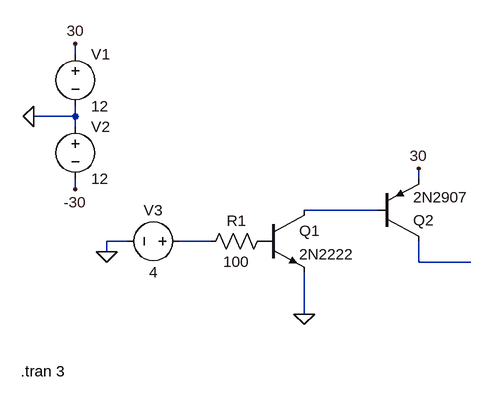
[diagram p0: schematic CurrentAmpTestBlock.asc]
CurrentAmpTestBlock.asc, the LTspice schematic file:
Version 4
SHEET 1 880 680
WIRE -128 -160 -128 -176
WIRE -128 -64 -128 -80
WIRE -128 -64 -192 -64
WIRE -128 -48 -128 -64
WIRE 400 32 400 16
WIRE -128 48 -128 32
WIRE 336 80 224 80
WIRE -48 128 -80 128
WIRE 80 128 32 128
WIRE -80 144 -80 128
WIRE 400 160 400 128
WIRE 480 160 400 160
WIRE 224 240 224 176
FLAG 400 16 30
FLAG -192 -64 0
FLAG -128 -176 30
FLAG -128 48 -30
FLAG -80 144 0
FLAG 224 240 0
SYMBOL res 176 112 R90
WINDOW 0 0 56 VBottom 2
WINDOW 3 32 56 VTop 2
SYMATTR InstName R1
SYMATTR Value 100
SYMBOL npn 160 80 R0
SYMATTR InstName Q1
SYMATTR Value 2N2222
SYMBOL pnp 336 128 M180
SYMATTR InstName Q2
SYMATTR Value 2N2907
SYMBOL voltage -128 -176 R0
WINDOW 123 0 0 Left 0
WINDOW 39 0 0 Left 0
SYMATTR InstName V1
SYMATTR Value 12
SYMBOL voltage -128 -64 R0
WINDOW 123 0 0 Left 0
WINDOW 39 0 0 Left 0
SYMATTR InstName V2
SYMATTR Value 12
SYMBOL voltage 48 128 R90
WINDOW 0 -32 56 VBottom 2
WINDOW 3 32 56 VTop 2
WINDOW 123 0 0 Left 0
WINDOW 39 0 0 Left 0
SYMATTR InstName V3
SYMATTR Value 4
TEXT -212 328 Left 2 !.tran 3

The netlist it stands for:
* CurrentAmpTestBlock.asc
R1 P001 N002 100
Q1 N001 P001 0 0 2N2222
Q2 N003 N001 30 0 2N2907
V1 30 0 12
V2 0 -30 12
V3 N002 0 4
.model NPN NPN
.model PNP PNP
.lib standard.bjt
.tran 3
.backanno
.end